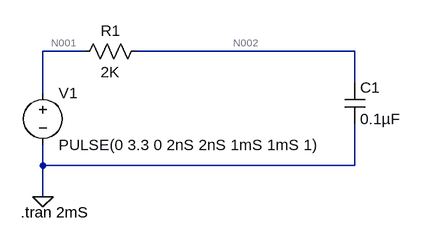
[diagram p0: schematic RC_Shaper.asc]
RC_Shaper.asc, the LTspice schematic file:
Version 4
SHEET 1 880 680
WIRE 176 64 112 64
WIRE 592 64 256 64
WIRE 592 112 592 64
WIRE 112 128 112 64
WIRE 112 240 112 208
WIRE 592 240 592 176
WIRE 592 240 112 240
WIRE 112 288 112 240
FLAG 112 288 0
SYMBOL voltage 112 112 R0
WINDOW 123 0 0 Left 0
WINDOW 39 0 0 Left 0
SYMATTR InstName V1
SYMATTR Value PULSE(0 3.3 0 2nS 2nS 1mS 1mS 1)
SYMBOL res 272 48 R90
WINDOW 0 0 56 VBottom 2
WINDOW 3 32 56 VTop 2
SYMATTR InstName R1
SYMATTR Value 2K
SYMBOL cap 576 112 R0
SYMATTR InstName C1
SYMATTR Value 0.1µF
TEXT 78 312 Left 2 !.tran 2mS

The netlist it stands for:
* RC_Shaper.asc
V1 N001 0 PULSE(0 3.3 0 2nS 2nS 1mS 1mS 1)
R1 N002 N001 2K
C1 N002 0 0.1µF
.tran 2mS
.backanno
.end

* Results of the author's LTspice run, read from the files saved beside the schematic
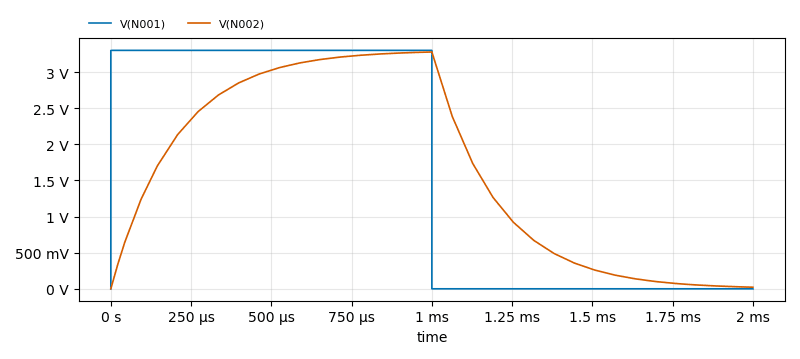
[diagram p1: Transient Analysis of RC_Shaper.asc, plotted from the saved traces]
* Transient Analysis, 1 run:
*   V(N001): min 0 V, max 3.3 V, average 1.65 V, rms 2.333 V, last 0 V
*   V(N002): min 0 V, max 3.278 V, average 1.649 V, rms 2.092 V, last 22.08 mV